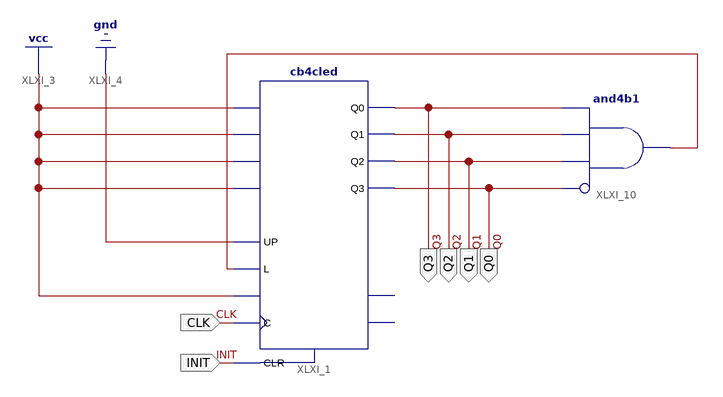
[diagram p0: schematic sheet 1]
// Xilinx ISE schematic ExamenP3ej1_v1.sch (spartan3) as structural Verilog: 2 symbols, 6 ports
module ExamenP3ej1_v1 (
  input  INIT,
  input  CLK,
  output Q0,
  output Q1,
  output Q2,
  output Q3
);

  wire XLXN_9;

  cb4cled XLXI_1 (
    .C(CLK), .CE(1'b1), .CLR(INIT), .D0(1'b1), .D1(1'b1), .D2(1'b1), .D3(1'b1), .L(XLXN_9), .UP(1'b0),
    .Q0(Q3), .Q1(Q2), .Q2(Q1), .Q3(Q0));  // open: CEO, TC
  and XLXI_10 (XLXN_9, ~Q0, Q1, Q2, Q3);  // and4b1
endmodule
